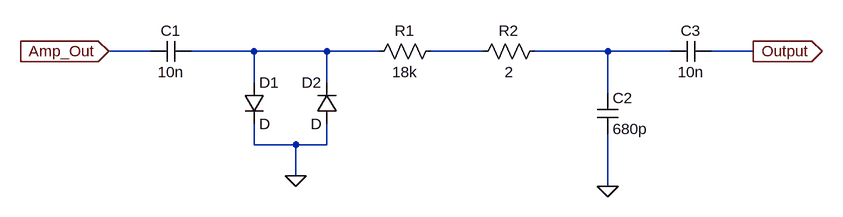
[diagram p0: schematic Clip_Draft.asc]
Clip_Draft.asc, the LTspice schematic file:
Version 4.1
SHEET 1 988 680
WIRE -80 192 -144 192
WIRE 80 192 -16 192
WIRE 192 192 80 192
WIRE 272 192 192 192
WIRE 432 192 352 192
WIRE 624 192 512 192
WIRE 720 192 624 192
WIRE 848 192 784 192
WIRE 80 240 80 192
WIRE 192 240 192 192
WIRE 624 256 624 192
WIRE 80 336 80 304
WIRE 144 336 80 336
WIRE 192 336 192 304
WIRE 192 336 144 336
WIRE 144 384 144 336
WIRE 624 400 624 320
FLAG 144 384 0
FLAG 624 400 0
FLAG -144 192 Amp_Out
IOPIN -144 192 In
FLAG 848 192 Output
IOPIN 848 192 Out
SYMBOL cap -16 176 R90
WINDOW 0 0 32 VBottom 2
WINDOW 3 32 32 VTop 2
SYMATTR InstName C1
SYMATTR Value 10n
SYMBOL diode 64 240 R0
SYMATTR InstName D1
SYMBOL diode 208 304 R180
WINDOW 0 24 64 Left 2
WINDOW 3 24 0 Left 2
SYMATTR InstName D2
SYMBOL res 368 176 R90
WINDOW 0 0 56 VBottom 2
WINDOW 3 32 56 VTop 2
SYMATTR InstName R1
SYMATTR Value 18k
SYMBOL res 528 176 R90
WINDOW 0 0 56 VBottom 2
WINDOW 3 32 56 VTop 2
SYMATTR InstName R2
SYMATTR Value 2
SYMBOL cap 608 256 R0
SYMATTR InstName C2
SYMATTR Value 680p
SYMBOL cap 784 176 R90
WINDOW 0 0 32 VBottom 2
WINDOW 3 32 32 VTop 2
SYMATTR InstName C3
SYMATTR Value 10n

The netlist it stands for:
* Clip_Draft.asc
C1 N001 Amp_Out 10n
D1 N001 0 D
D2 0 N001 D
R1 N002 N001 18k
R2 N003 N002 2
C2 N003 0 680p
C3 Output N003 10n
.model D D
.lib standard.dio
.backanno
.end